# Altium schematic sheet Myscheme.SchDoc
size A1
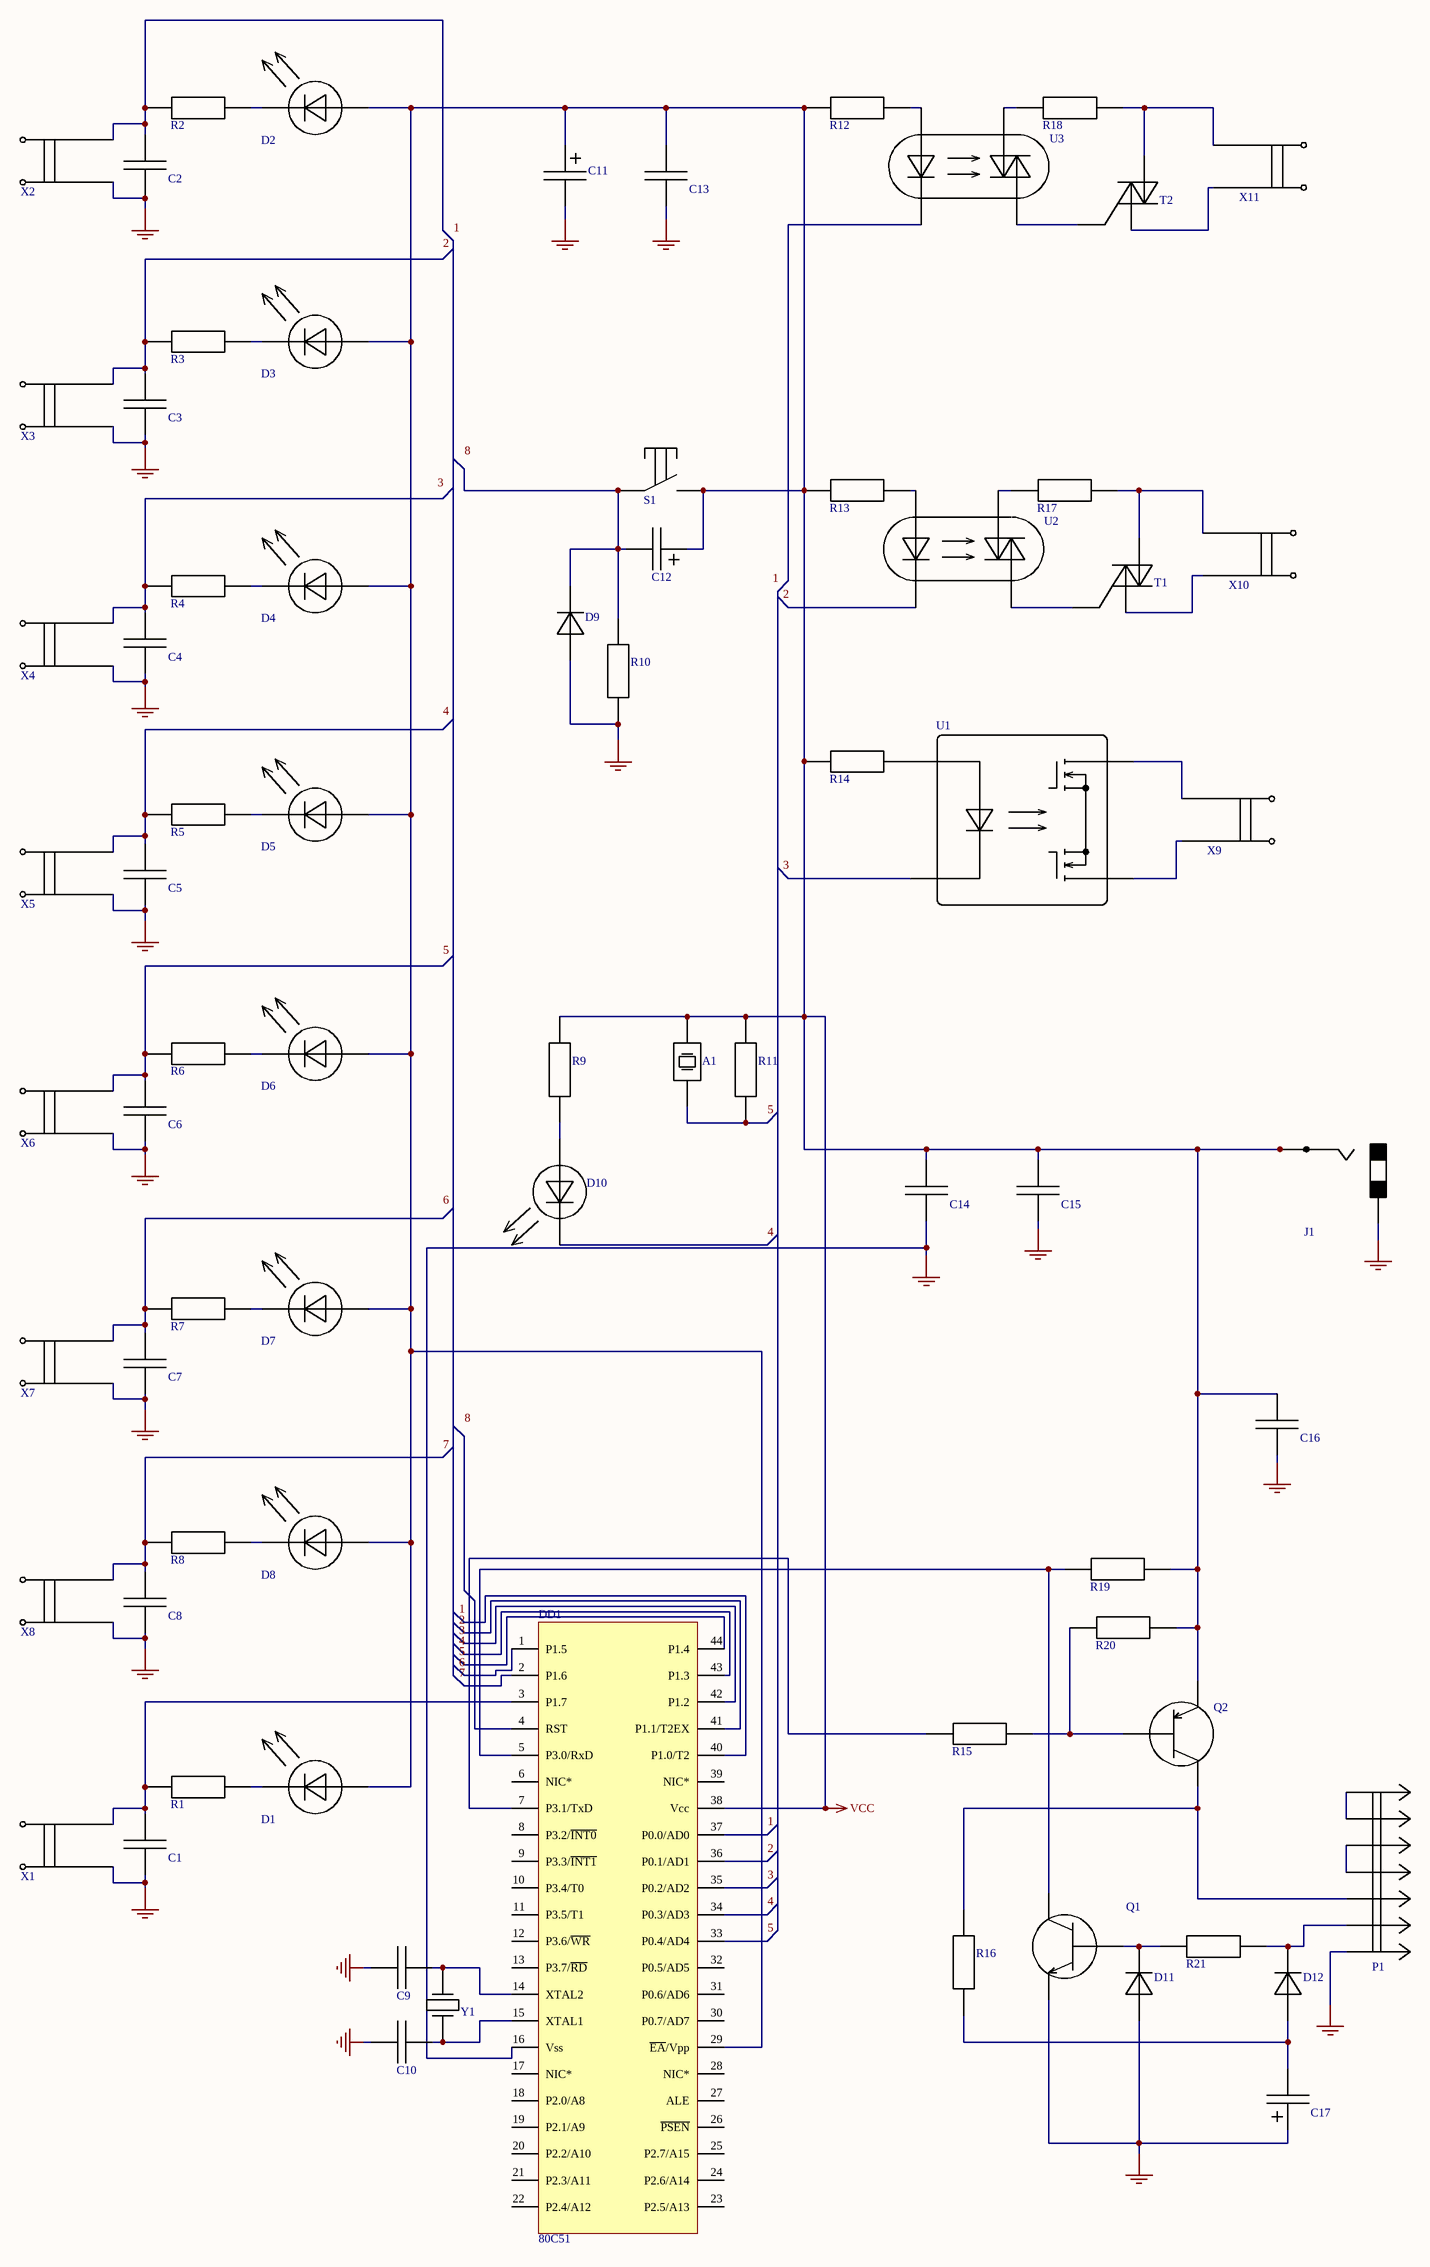
[diagram p0: Myscheme.SchDoc]

## Parts
A1  acoustic  [BUZZER_RM_5MM_PKM13EPYH4002-B0(Primary) - duplicate]  (value not drawn)
C1  Cap  [RAD-0.3]  (value not drawn)
C2  Cap  [RAD-0.3]  (value not drawn)
C3  Cap  [RAD-0.3]  (value not drawn)
C4  Cap  [RAD-0.3]  (value not drawn)
C5  Cap  [RAD-0.3]  (value not drawn)
C6  Cap  [RAD-0.3]  (value not drawn)
C7  Cap  [RAD-0.3]  (value not drawn)
C8  Cap  [RAD-0.3]  (value not drawn)
C9  Cap  [RAD-0.3]  (value not drawn)
C10  Cap  [RAD-0.3]  (value not drawn)
C11  Cap+  [RB7.6-15]  (value not drawn)
C12  Cap+  [RB7.6-15]  (value not drawn)
C13  Cap  [RAD-0.3]  (value not drawn)
C14  Cap  [RAD-0.3]  (value not drawn)
C15  Cap  [RAD-0.3]  (value not drawn)
C16  Cap  [RAD-0.3]  (value not drawn)
C17  Cap+  [RB7.6-15]  (value not drawn)
D1  LED  [LED-1]  (value not drawn)
D2  LED  [LED-1]  (value not drawn)
D3  LED  [LED-1]  (value not drawn)
D4  LED  [LED-1]  (value not drawn)
D5  LED  [LED-1]  (value not drawn)
D6  LED  [LED-1]  (value not drawn)
D7  LED  [LED-1]  (value not drawn)
D8  LED  [LED-1]  (value not drawn)
D9  (no value)  [DIOAD730W55L340D162P_1N4148(Primary)]
D10  LED  [LED-1]  (value not drawn)
D11  (no value)  [DIOAD730W55L340D162P_1N4148(Primary)]
D12  (no value)  [DIOAD730W55L340D162P_1N4148(Primary)]
DD1  80C51  [QFP80P1260X1260X210-44N]
J1  phonejack  [JACK/6-V2]  (value not drawn)
P1  plug  [PIN1]  (value not drawn)
Q1  (no value)  [TO-92A]
Q2  (no value)  [TO92127P520H534-3]
R1  Res  [PCBComponent_1]  (value not drawn)
R2  Res  [PCBComponent_1]  (value not drawn)
R3  Res  [PCBComponent_1]  (value not drawn)
R4  Res  [PCBComponent_1]  (value not drawn)
R5  Res  [PCBComponent_1]  (value not drawn)
R6  Res  [PCBComponent_1]  (value not drawn)
R7  Res  [PCBComponent_1]  (value not drawn)
R8  Res  [PCBComponent_1]  (value not drawn)
R9  Res  [PCBComponent_1]  (value not drawn)
R10  Res  [PCBComponent_1]  (value not drawn)
R11  Res  [PCBComponent_1]  (value not drawn)
R12  Res  [PCBComponent_1]  (value not drawn)
R13  Res  [PCBComponent_1]  (value not drawn)
R14  Res  [PCBComponent_1]  (value not drawn)
R15  Res  [PCBComponent_1]  (value not drawn)
R16  Res  [PCBComponent_1]  (value not drawn)
R17  Res  [PCBComponent_1]  (value not drawn)
R18  Res  [PCBComponent_1]  (value not drawn)
R19  Res  [PCBComponent_1]  (value not drawn)
R20  Res  [PCBComponent_1]  (value not drawn)
R21  Res  [PCBComponent_1]  (value not drawn)
S1  SW-SPST  [SPST-2]  (value not drawn)
T1  (no value)  [TO-220-ALT]
T2  (no value)  [TO-220-ALT]
U1  (no value)  [SOIC254P610X218-4N]
U2  (no value)  [SOIC254P1016X460-6N]
U3  (no value)  [SOIC254P1016X460-6N]
X1  Entrance  [P-2059-301/998-403_2059-301/998-403(Primary)]  (value not drawn)
X2  Entrance  [P-2059-301/998-403_2059-301/998-403(Primary)]  (value not drawn)
X3  Entrance  [P-2059-301/998-403_2059-301/998-403(Primary)]  (value not drawn)
X4  Entrance  [P-2059-301/998-403_2059-301/998-403(Primary)]  (value not drawn)
X5  Entrance  [P-2059-301/998-403_2059-301/998-403(Primary)]  (value not drawn)
X6  Entrance  [P-2059-301/998-403_2059-301/998-403(Primary)]  (value not drawn)
X7  Entrance  [P-2059-301/998-403_2059-301/998-403(Primary)]  (value not drawn)
X8  Entrance  [P-2059-301/998-403_2059-301/998-403(Primary)]  (value not drawn)
X9  Entrance  [P-2059-301/998-403_2059-301/998-403(Primary)]  (value not drawn)
X10  Entrance  [P-2059-301/998-403_2059-301/998-403(Primary)]  (value not drawn)
X11  Entrance  [P-2059-301/998-403_2059-301/998-403(Primary)]  (value not drawn)
Y1  XTAL  [R38]  (value not drawn)

## Nets
GND: C1.2 C2.2 C3.2 C4.2 C5.2 C6.2 C7.2 C8.2 C9.2 C10.2 C11.2 C13.2 C14.2 C15.2 C16.2 C17.1 D9.C D11.C DD1.16(Vss) J1.5 P1.5 Q1.1 R10.2 X1.L1.2 X2.L1.2 X3.L1.2 X4.L1.2 X5.L1.2 X6.L1.2 X7.L1.2 X8.L1.2
VCC: A1.NEG C11.1 C12.1 C13.1 C14.1 C15.1 C16.1 D1.2 D2.2 D3.2 D4.2 D5.2 D6.2 D7.2 D8.2 DD1.29(~{EA}/Vpp) DD1.38(Vcc) J1.1 Q2.1 R9.1 R11.1 R12.2 R13.2 R14.2 R19.2 R20.2 S1.2
NetA1_POS: A1.POS R11.2
NetC1_1: C1.1 DD1.3(P1.7) R1.2 X1.L1.1
NetC2_1: C2.1 R2.2 X2.L1.1
NetC3_1: C3.1 R3.2 X3.L1.1
NetC4_1: C4.1 R4.2 X4.L1.1
NetC5_1: C5.1 R5.2 X5.L1.1
NetC6_1: C6.1 R6.2 X6.L1.1
NetC7_1: C7.1 R7.2 X7.L1.1
NetC8_1: C8.1 R8.2 X8.L1.1
NetC9_1: C9.1 DD1.14(XTAL2) Y1.2
NetC10_1: C10.1 DD1.15(XTAL1) Y1.1
NetC12_2: C12.2 D9.A R10.1 S1.1
NetC17_2: C17.2 D12.C R16.1
NetD1_1: D1.1 R1.1
NetD2_1: D2.1 R2.1
NetD3_1: D3.1 R3.1
NetD4_1: D4.1 R4.1
NetD5_1: D5.1 R5.1
NetD6_1: D6.1 R6.1
NetD7_1: D7.1 R7.1
NetD8_1: D8.1 R8.1
NetD10_2: D10.2 R9.2
NetD11_A: D11.A Q1.2 R21.1
NetD12_A: D12.A P1.2 R21.2
NetDD1_5: DD1.5(P3.0/RxD) Q1.3 R19.1
NetDD1_7: DD1.7(P3.1/TxD) R15.1
NetP1_3: P1.3 Q2.3 R16.2
NetP1_4: P1.4 P1.6
NetP1_7: P1.7 P1.8
NetQ2_2: Q2.2 R15.2 R20.1
NetR12_1: R12.1 U3.1
NetR13_1: R13.1 U2.1
NetR14_1: R14.1 U1.1
NetR17_1: R17.1 T1.GND X10.L1.2
NetR17_2: R17.2 U2.6
NetR18_1: R18.1 T2.GND X11.L1.2
NetR18_2: R18.2 U3.6
NetT1_IN: T1.IN X10.L1.1
NetT1_OUT: T1.OUT U2.4
NetT2_IN: T2.IN X11.L1.1
NetT2_OUT: T2.OUT U3.4
NetU1_3: U1.3 X9.L1.2
NetU1_4: U1.4 X9.L1.1

Not connected (* = marked no-connect by the designer): D10 1; DD1 1(P1.5) 2(P1.6) 4(RST) 6(NIC*) 8(P3.2/~{INT0}) 9(P3.3/~{INT1}) 10(P3.4/T0) 11(P3.5/T1) 12(P3.6/~{WR}) 13(P3.7/~{RD}) 17(NIC*) 18(P2.0/A8) 19(P2.1/A9) 20(P2.2/A10) 21(P2.3/A11) 22(P2.4/A12) 23(P2.5/A13) 24(P2.6/A14) 25(P2.7/A15) 26(~{PSEN}) 27(ALE) 28(NIC*) 30(P0.7/AD7) 31(P0.6/AD6) 32(P0.5/AD5) 33(P0.4/AD4) 34(P0.3/AD3) 35(P0.2/AD2) 36(P0.1/AD1) 37(P0.0/AD0) 39(NIC*) 40(P1.0/T2) 41(P1.1/T2EX) 42(P1.2) 43(P1.3) 44(P1.4); U1 2; U2 2; U3 2

## Notes on the sheet
- Labels drawn without touching a wire or pin: 1, 2, 3, 4, 5, 6, 7, 8

## Library data of the parts
C1-C10 C13-C16 = Cap: Capacitor
D9 D11 D12 = 1N4148
Q1 = КТ315Б
Q2 = КТ361Б
T1 T2 = BT138-600
U1 = CPC1035N
U2 U3 = MOC3020M